# Altium schematic sheet Power.SchDoc: Power
size A3; DrawnBy: Mogens Groth Nicolaisen; DocumentNumber: 5; SheetNumber: 5; SheetTotal: 7
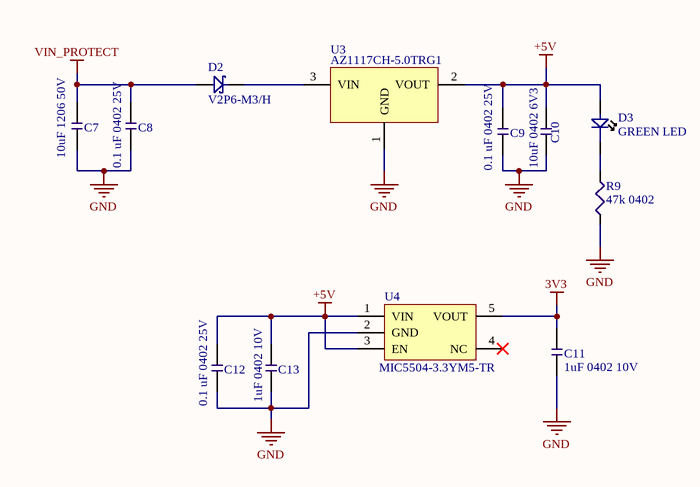
[diagram p0: Power.SchDoc]

## Parts
C7  10uF 1206 50V  [CAP_1206]
C8  0.1 uF 0402 25V  [CAP_0402]
C9  0.1 uF 0402 25V  [CAP_0402]
C10  10uF 0402 6V3  [CAP_0402]
C11  1uF 0402 10V  [CAP_0402]
C12  0.1 uF 0402 25V  [CAP_0402]
C13  1uF 0402 10V  [CAP_0402]
D2  V2P6-M3/H  [MicroSMP]
D3  GREEN LED  [0402 LED]
R9  47k 0402  [RES_0402]
U3  AZ1117CH-5.0TRG1  [SOT230P700X180-4N]
U4  MIC5504-3.3YM5-TR  [SOT95P280X130-5N]

## Nets
3V3: C11.2 U4.5(VOUT)
+5V: C9.2 C10.2 C12.2 C13.2 D3.1 U3.2(VOUT) U4.1(VIN) U4.3(EN)
GND: C7.1 C8.1 C9.1 C10.1 C11.1 C12.1 C13.1 R9.1 U3.1(GND) U4.2(GND)
VIN_PROTECT: C7.2 C8.2 D2.1
NetD2_2: D2.2 U3.3(VIN)
NetD3_2: D3.2 R9.2

Not connected (* = marked no-connect by the designer): U4 4(NC)*

## Notes on the sheet
- ON Development
- Title:
- Size:
- A3
- Drawn By:
- Date:
- Sheet
- of
- Revision:

## Library data of the parts
C7 = CMP-00030-4: 10uF 1206 50V X5R 20%; Tolerance: +/- 20%; Value: 10uF; Voltage: 50 V
C8 C9 C12 = CMP-00061-4: 0.1UF 25V 10% X5R 0402; Mfg. Part Number: TMK105BJ104KV-F; Tolerance: 10%; Value: 0.1 uF; Voltage: 25V
C10 = CMP-00011-3: 10uF 20% 0402 6V3 X6S; Current Rating: -; Tolerance: 20%; Value: 10uF; Voltage: 6V3
C11 C13 = CMP-00032-4: 1uF 0402 10V 10% X5R; Tolerance: 10 %; Value: 1 uF; Voltage: 10 V
D2 = CMP-016-0002-2: DIODE SCHOTTKY 60V 2A MICROSMP
D3 = CMP-008-0001-2: 0402 SMD LED; Mfg. Part Number: LTST-C281KGKT
R9 = CMP-001-0027-3: RES SMD 47K OHM 1% 1/16W 0402; Mfg. Part Number: RMCF0402FT47K0; Case/Package: 0402; Power: 1/16W; Tolerance: 1%; Value: 47k
U3 = CMP-00060-4: IC REG LINEAR 5V 800MA SOT223; Mfg. Part Number: AZ1117CH-5.0TRG1
U4 = CMP-00031-4: LDO Voltage Regulators Single 300mA